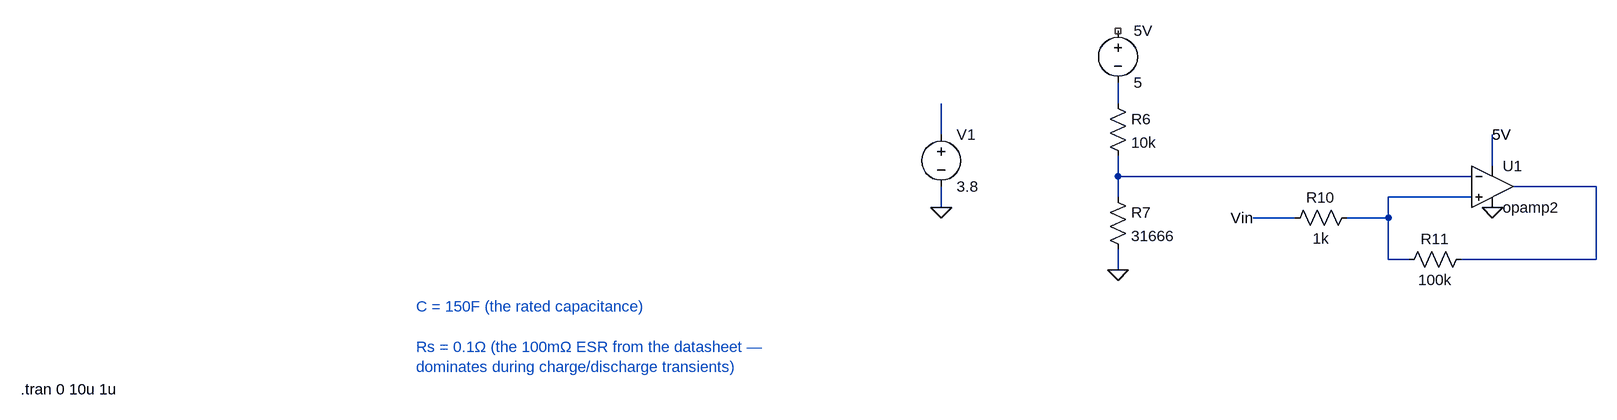
[diagram p0: schematic smarts.asc]
smarts.asc, the LTspice schematic file:
Version 4.1
SHEET 1 2676 760
WIRE 1872 304 1872 272
WIRE 1600 352 1600 304
WIRE 2448 400 2448 352
WIRE 1872 416 1872 384
WIRE 2416 416 1872 416
WIRE 2608 432 2480 432
WIRE 1872 448 1872 416
WIRE 2416 448 2288 448
WIRE 1600 464 1600 432
WIRE 2144 480 2080 480
WIRE 2288 480 2288 448
WIRE 2288 480 2224 480
WIRE 2288 544 2288 480
WIRE 2320 544 2288 544
WIRE 2608 544 2608 432
WIRE 2608 544 2400 544
WIRE 1872 560 1872 528
FLAG 2448 464 0
FLAG 1872 560 0
FLAG 1600 464 0
SYMBOL OpAmps\\opamp2 2448 368 R0
SYMATTR InstName U1
SYMBOL res 2416 528 R90
WINDOW 0 0 56 VBottom 2
WINDOW 3 32 56 VTop 2
SYMATTR InstName R11
SYMATTR Value 100k
SYMBOL res 2240 464 R90
WINDOW 0 0 56 VBottom 2
WINDOW 3 32 56 VTop 2
SYMATTR InstName R10
SYMATTR Value 1k
SYMBOL voltage 1872 176 R0
WINDOW 123 0 0 Left 0
WINDOW 39 0 0 Left 0
SYMATTR InstName 5V
SYMATTR Value 5
SYMBOL res 1856 288 R0
SYMATTR InstName R6
SYMATTR Value 10k
SYMBOL res 1856 432 R0
SYMATTR InstName R7
SYMATTR Value 31666
SYMBOL voltage 1600 336 R0
SYMATTR InstName V1
SYMATTR Value 3.8
TEXT 792 616 Left 2 ;C = 150F (the rated capacitance)\n \nRs = 0.1Ω (the 100mΩ ESR from the datasheet — \ndominates during charge/discharge transients)
TEXT 2448 352 Left 2 !5V
TEXT 184 744 Left 2 !.tran 0 10u 1u
TEXT 2080 480 Right 2 !Vin

The netlist it stands for:
* smarts.asc
X§U1 N006 N004 N003 0 N005 opamp2  ; pins In+ In- V+ V- OUT
R11 N005 N006 100k
R10 N006 N007 1k
V§5V NC_01 N001 5
R6 N001 N004 10k
R7 N004 0 31666
V1 N002 0 3.8
* C = 150F (the rated capacitance)
* Rs = 0.1Ω (the 100mΩ ESR from the datasheet —
* dominates during charge/discharge transients)
5V
.tran 0 10u 1u
Vin
.backanno
.end